# EasyEDA schematic Land Traffic Controller.json

## Sheets
1 LEDs: TITLE: LEDs; REV: 1.0; Date: 2019-06-13; Sheet: 1/1; Drawn By: Gabriel Barbosa; Company: PTR - UnB
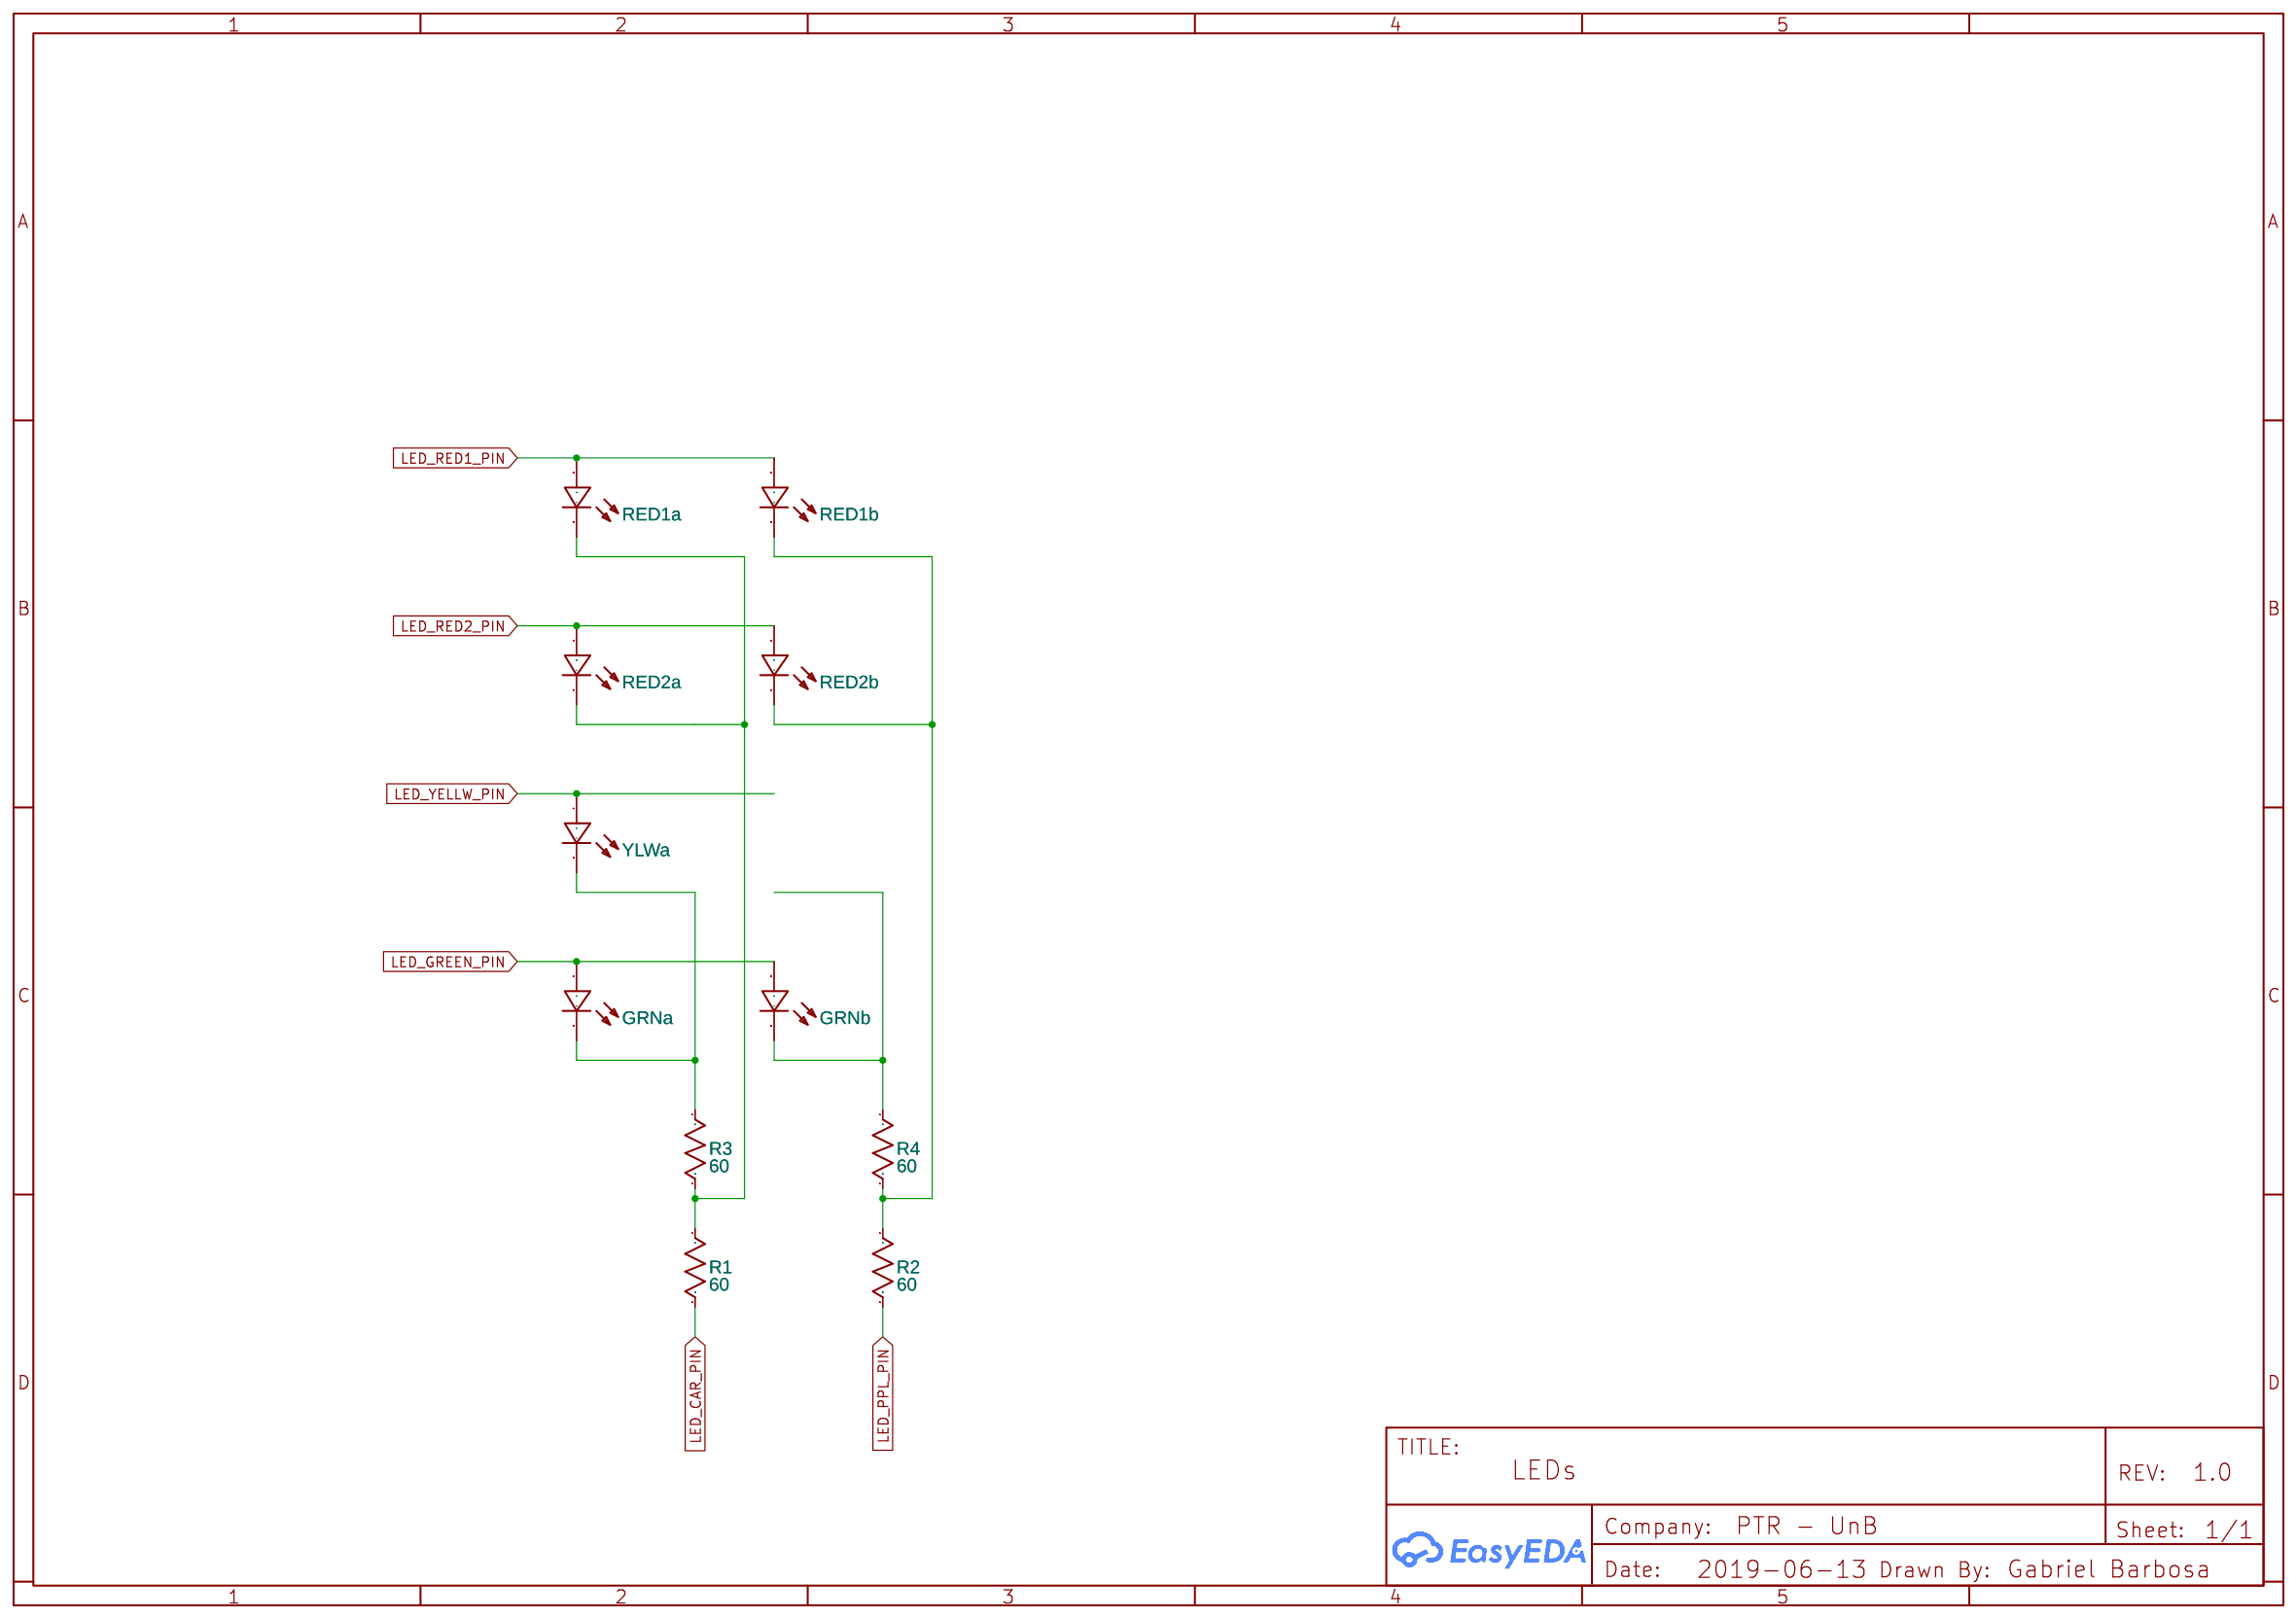
[diagram p0: LEDs]
2 Sensors: TITLE: Sensors; Date: 2019-06-30; Drawn By: UserSupport; Company: Your Company
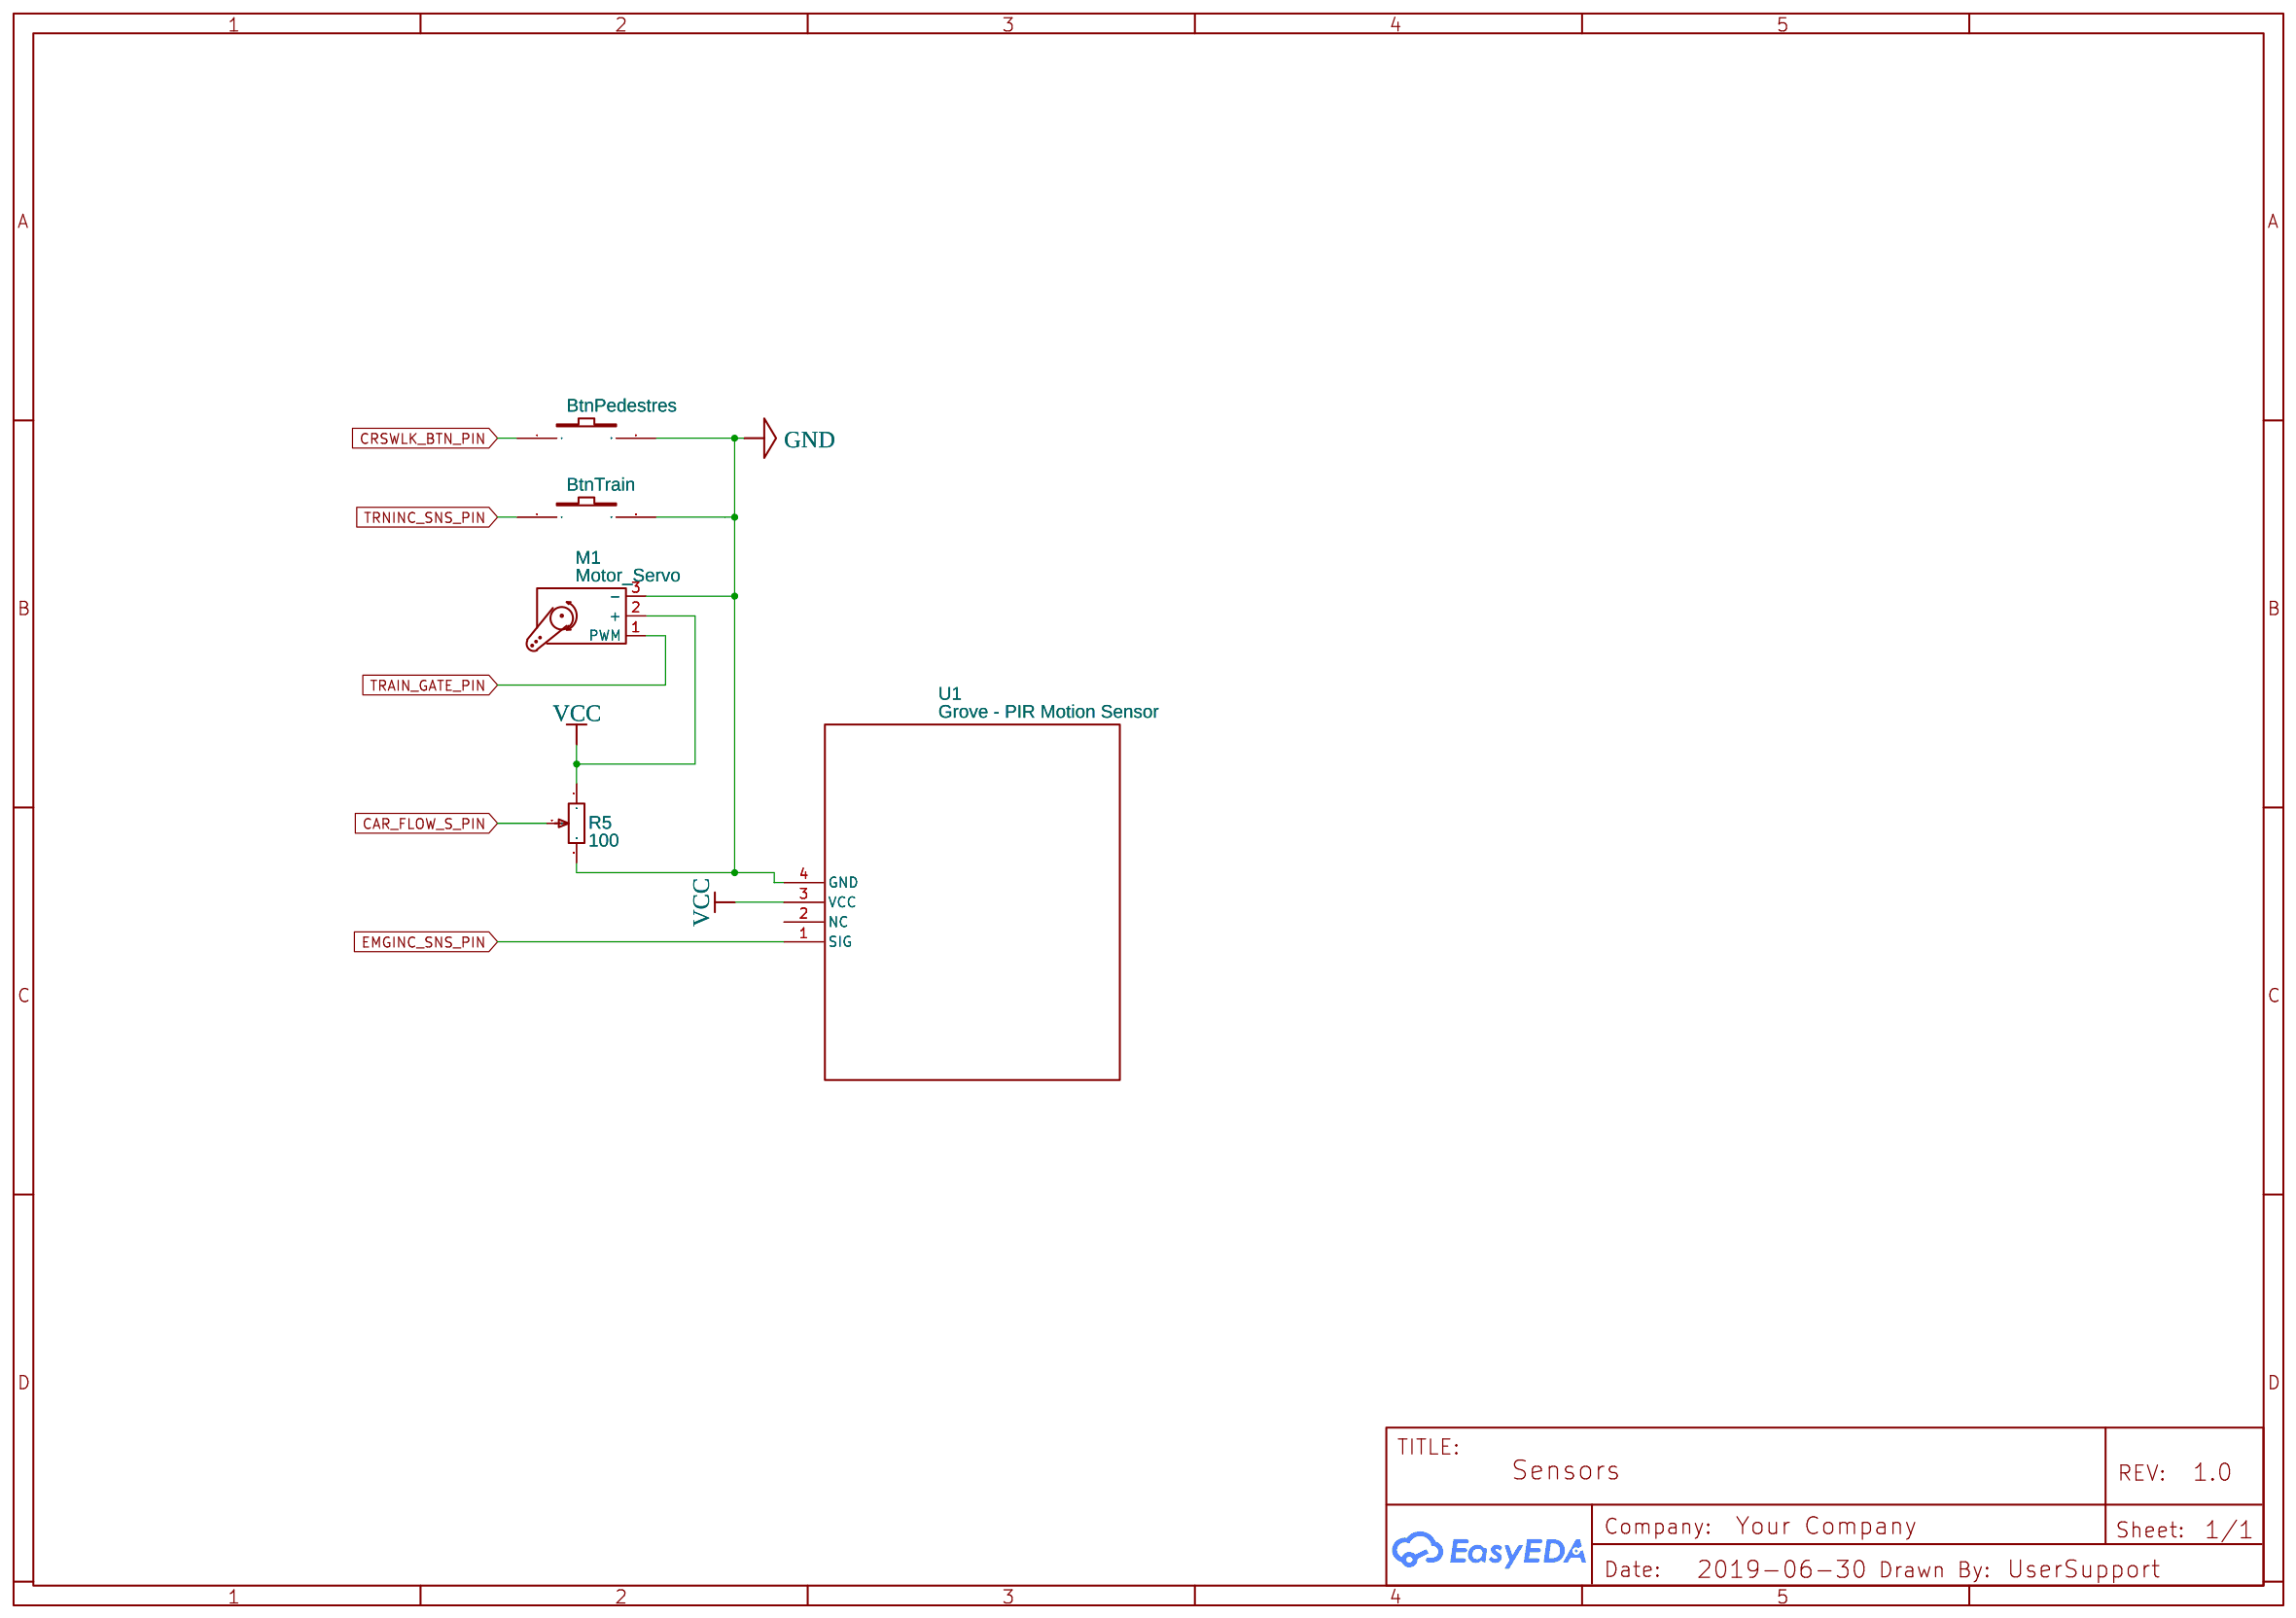
[diagram p1: Sensors]

## Parts
sheet LEDs
LED1  RED1a  [LED-3MM/2.54]
LED2  RED1b  [LED-3MM/2.54]
LED3  RED2a  [LED-3MM/2.54]
LED4  RED2b  [LED-3MM/2.54]
LED5  YLWa  [LED-3MM/2.54]
LED7  GRNa  [LED-3MM/2.54]
LED8  GRNb  [LED-3MM/2.54]
R1  60  [AXIAL-0.3]
R2  60  [AXIAL-0.3]
R3  60  [AXIAL-0.3]
R4  60  [AXIAL-0.3]
sheet Sensors
M1  Motor_Servo
R5  100  [RES-ADJ_3386P]
SW1  BtnPedestres  [KEY-6.0*6.0-4]
SW2  BtnTrain  [KEY-6.0*6.0-4]
U1  Grove - PIR Motion Sensor  [GROVE - PIR MOTION SENSOR]

## Library data of the parts
LED1-LED5 LED7 LED8 = -: Supplier: LCSC; Manufacturer: EVERLIGHT; Manufacturer Part: 204-10SURD/S530-A3; Supplier Part: C99772; Package Display: No
R1-R4 = Res_AXIAL-0.3(1/8W)_US: Manufacturer Part: ?
M1 = -: Contributor: KiCAD; license: https://www.gnu.org/licenses/lgpl-2.1.html; Manufacturer Part: ?
R5 = 3386P-1-101LF: Supplier: LCSC; Manufacturer: Bochen; Supplier Part: C125022
SW1 SW2 = -: Supplier: LCSC; Manufacturer: PANASONIC; Manufacturer Part: EVQ22705R; Contributor: LCSC; Supplier Part: C79156
U1 = -: sourceId: VpBbLkUSs; Supplier Part: undefined; Supplier: SeeedStudio; Manufacturer Part: ?

## Nets
GND: M1.3(-) R5.3 SW1.2 SW2.2 U1.4(GND)
VCC: M1.2(+) R5.1 U1.3(VCC)
CAR_FLOW_S_PIN: R5.2
CRSWLK_BTN_PIN: SW1.1
EMGINC_SNS_PIN: U1.1(SIG)
LED_CAR_PIN: R1.2
LED_GREEN_PIN: LED7.1(+) LED8.1(+)
LED_PPL_PIN: R2.2
LED_RED1_PIN: LED1.1(+) LED2.1(+)
LED_RED2_PIN: LED3.1(+) LED4.1(+)
LED_YELLW_PIN: LED5.1(+)
TRAIN_GATE_PIN: M1.1(PWM)
TRNINC_SNS_PIN: SW2.1
Net-(LED1-2): LED1.2(-) LED3.2(-) R1.1 R3.2
Net-(LED2-2): LED2.2(-) LED4.2(-) R2.1 R4.2
Net-(LED5-2): LED5.2(-) LED7.2(-) R3.1
Net-(LED8-2): LED8.2(-) R4.1

Not connected (* = marked no-connect by the designer): U1 2(NC)
